# Altium schematic sheet PIC32.SchDoc
size A; PageSetup: Record=PageOptions|CenterHorizontal=True|CenterVertical=True|PrintScale=1.07|XCorrection=1.00|YCorrection=1.00|PrintKind=1|BorderSize=5000000|LeftOffset=0|BottomOffset=0|Orientation=2|PaperLength=1000|PaperWidth=1000|Scale=100|PaperSource=7|PrintQuality=-4|MediaType=1|DitherType=10|PaperKind=A5|PrintScaleMode=1
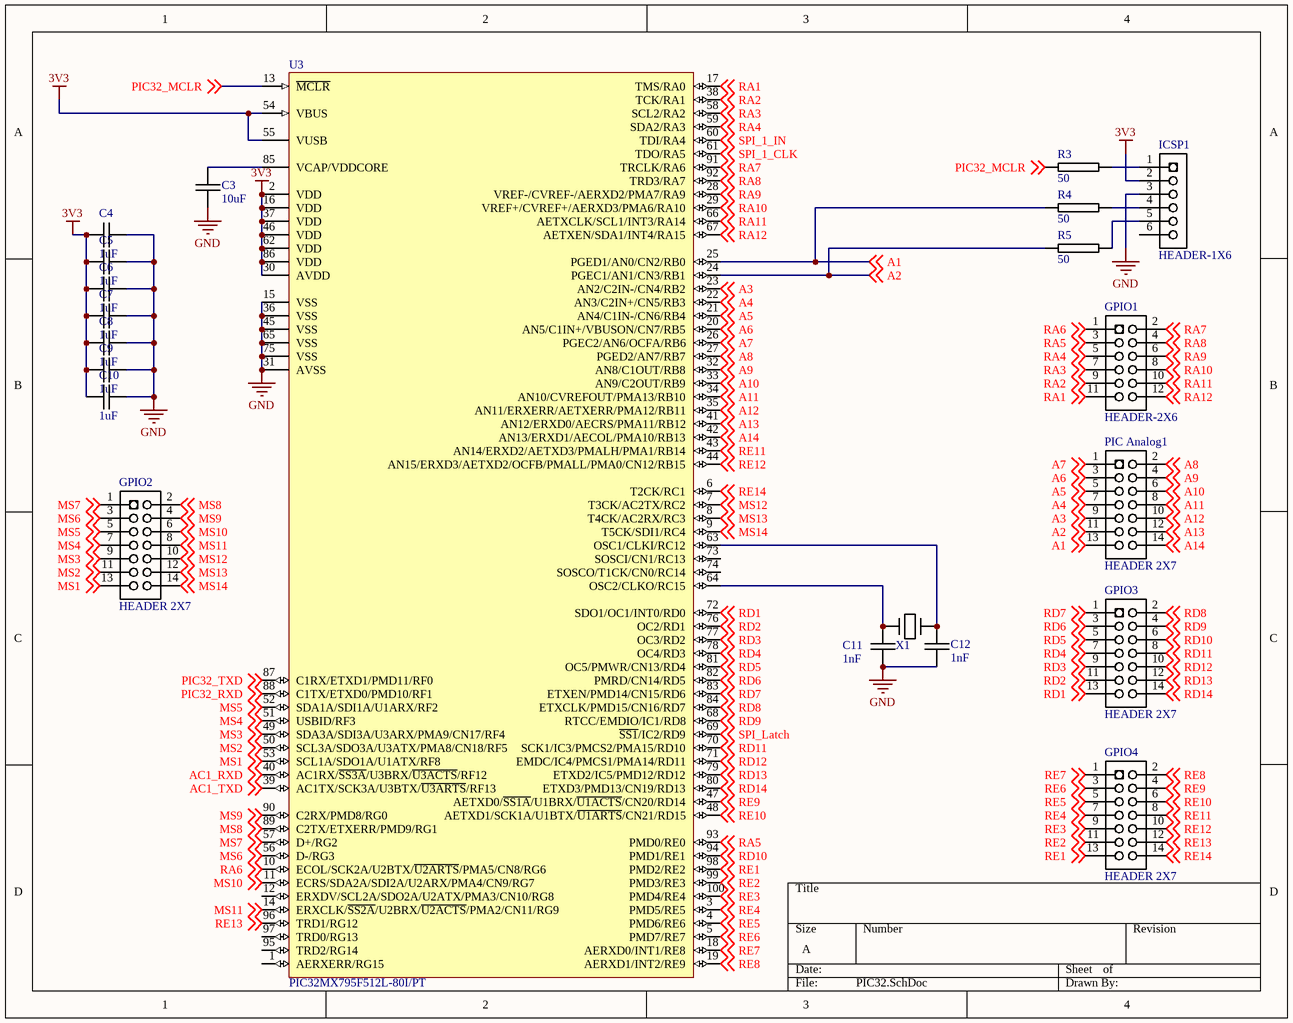
[diagram p0: PIC32.SchDoc]

## Parts
C3  10uF  [0603C-GENERIC]
C4  1uF  [0603C-GENERIC]
C5  1uF  [0603C-GENERIC]
C6  1uF  [0603C-GENERIC]
C7  1uF  [0603C-GENERIC]
C8  1uF  [0603C-GENERIC]
C9  1uF  [0603C-GENERIC]
C10  1uF  [0603C-GENERIC]
C11  1nF  [0603C-GENERIC]
C12  1nF  [0603C-GENERIC]
GPIO1  HEADER-2X6  [HEADER-2X6]
GPIO2  HEADER 2X7  [HEADER-2X7]
GPIO3  HEADER 2X7  [HEADER-2X7]
GPIO4  HEADER 2X7  [HEADER-2X7]
ICSP1  HEADER-1X6  [HEADER-1X6]
PIC_Analog1  HEADER 2X7  [HEADER-2X7]
R3  50  [0603R-TBD]
R4  50  [0603R-TBD]
R5  50  [0603R-TBD]
U3  PIC32MX795F512L-80I/PT  [TQFP-PT100_N]
X1  CRYSTAL-GENERIC  [XTAL-RU49/4]  (value not drawn)

## Nets
3V3: C4.1 C5.1 C6.1 C7.1 C8.1 C9.1 C10.1 ICSP1.2 U3.2(VDD) U3.16(VDD) U3.30(AVDD) U3.37(VDD) U3.46(VDD) U3.54(VBUS) U3.55(VUSB) U3.62(VDD) U3.86(VDD)
GND: C3.2 C4.2 C5.2 C6.2 C7.2 C8.2 C9.2 C10.2 C11.2 C12.2 ICSP1.3 U3.15(VSS) U3.31(AVSS) U3.36(VSS) U3.45(VSS) U3.65(VSS) U3.75(VSS)
A1: PIC_Analog1.13 R4.1 U3.25(PGED1/AN0/CN2/RB0) ; off-sheet A1
A2: PIC_Analog1.11 R5.2 U3.24(PGEC1/AN1/CN3/RB1) ; off-sheet A2
A3: PIC_Analog1.9 U3.23(AN2/C2IN-/CN4/RB2) ; off-sheet A3
A4: PIC_Analog1.7 U3.22(AN3/C2IN+/CN5/RB3) ; off-sheet A4
A5: PIC_Analog1.5 U3.21(AN4/C1IN-/CN6/RB4) ; off-sheet A5
A6: PIC_Analog1.3 U3.20(AN5/C1IN+/VBUSON/CN7/RB5) ; off-sheet A6
A7: PIC_Analog1.1 U3.26(PGEC2/AN6/OCFA/RB6) ; off-sheet A7
A8: PIC_Analog1.2 U3.27(PGED2/AN7/RB7) ; off-sheet A8
A9: PIC_Analog1.4 U3.32(AN8/C1OUT/RB8) ; off-sheet A9
A10: PIC_Analog1.6 U3.33(AN9/C2OUT/RB9) ; off-sheet A10
A11: PIC_Analog1.8 U3.34(AN10/CVREFOUT/PMA13/RB10) ; off-sheet A11
A12: PIC_Analog1.10 U3.35(AN11/ERXERR/AETXERR/PMA12/RB11) ; off-sheet A12
A13: PIC_Analog1.12 U3.41(AN12/ERXD0/AECRS/PMA11/RB12) ; off-sheet A13
A14: PIC_Analog1.14 U3.42(AN13/ERXD1/AECOL/PMA10/RB13) ; off-sheet A14
AC1_RXD: U3.40(AC1RX/~{SS3A}/U3BRX/~{U3ACTS}/RF12) ; off-sheet AC1_RXD
AC1_TXD: U3.39(AC1TX/SCK3A/U3BTX/~{U3ARTS}/RF13) ; off-sheet AC1_TXD
MS1: GPIO2.13 U3.53(SCL1A/SDO1A/U1ATX/RF8) ; off-sheet MS1
MS2: GPIO2.11 U3.50(SCL3A/SDO3A/U3ATX/PMA8/CN18/RF5) ; off-sheet MS2
MS3: GPIO2.9 U3.49(SDA3A/SDI3A/U3ARX/PMA9/CN17/RF4) ; off-sheet MS3
MS4: GPIO2.7 U3.51(USBID/RF3) ; off-sheet MS4
MS5: GPIO2.5 U3.52(SDA1A/SDI1A/U1ARX/RF2) ; off-sheet MS5
MS6: GPIO2.3 U3.56(D-/RG3) ; off-sheet MS6
MS7: GPIO2.1 U3.57(D+/RG2) ; off-sheet MS7
MS8: GPIO2.2 U3.89(C2TX/ETXERR/PMD9/RG1) ; off-sheet MS8
MS9: GPIO2.4 U3.90(C2RX/PMD8/RG0) ; off-sheet MS9
MS10: GPIO2.6 U3.11(ECRS/SDA2A/SDI2A/U2ARX/PMA4/CN9/RG7) ; off-sheet MS10
MS11: GPIO2.8 U3.14(ERXCLK/~{SS2A}/U2BRX/~{U2ACTS}/PMA2/CN11/RG9) ; off-sheet MS11
MS12: GPIO2.10 U3.7(T3CK/AC2TX/RC2) ; off-sheet MS12
MS13: GPIO2.12 U3.8(T4CK/AC2RX/RC3) ; off-sheet MS13
MS14: GPIO2.14 U3.9(T5CK/SDI1/RC4) ; off-sheet MS14
PIC32_MCLR: R3.2 U3.13(~{MCLR}) ; off-sheet PIC32_MCLR
PIC32_RXD: U3.88(C1TX/ETXD0/PMD10/RF1) ; off-sheet PIC32_RXD
PIC32_TXD: U3.87(C1RX/ETXD1/PMD11/RF0) ; off-sheet PIC32_TXD
RA1: GPIO1.11 U3.17(TMS/RA0) ; off-sheet RA1
RA2: GPIO1.9 U3.38(TCK/RA1) ; off-sheet RA2
RA3: GPIO1.7 U3.58(SCL2/RA2) ; off-sheet RA3
RA4: GPIO1.5 U3.59(SDA2/RA3) ; off-sheet RA4
RA5: GPIO1.3 U3.93(PMD0/RE0) ; off-sheet RA5
RA6: GPIO1.1 U3.10(ECOL/SCK2A/U2BTX/~{U2ARTS}/PMA5/CN8/RG6) ; off-sheet RA6
RA7: GPIO1.2 U3.91(TRCLK/RA6) ; off-sheet RA7
RA8: GPIO1.4 U3.92(TRD3/RA7) ; off-sheet RA8
RA9: GPIO1.6 U3.28(VREF-/CVREF-/AERXD2/PMA7/RA9) ; off-sheet RA9
RA10: GPIO1.8 U3.29(VREF+/CVREF+/AERXD3/PMA6/RA10) ; off-sheet RA10
RA11: GPIO1.10 U3.66(AETXCLK/SCL1/INT3/RA14) ; off-sheet RA11
RA12: GPIO1.12 U3.67(AETXEN/SDA1/INT4/RA15) ; off-sheet RA12
RD1: GPIO3.13 U3.72(SDO1/OC1/INT0/RD0) ; off-sheet RD1
RD2: GPIO3.11 U3.76(OC2/RD1) ; off-sheet RD2
RD3: GPIO3.9 U3.77(OC3/RD2) ; off-sheet RD3
RD4: GPIO3.7 U3.78(OC4/RD3) ; off-sheet RD4
RD5: GPIO3.5 U3.81(OC5/PMWR/CN13/RD4) ; off-sheet RD5
RD6: GPIO3.3 U3.82(PMRD/CN14/RD5) ; off-sheet RD6
RD7: GPIO3.1 U3.83(ETXEN/PMD14/CN15/RD6) ; off-sheet RD7
RD8: GPIO3.2 U3.84(ETXCLK/PMD15/CN16/RD7) ; off-sheet RD8
RD9: GPIO3.4 U3.68(RTCC/EMDIO/IC1/RD8) ; off-sheet RD9
RD10: GPIO3.6 U3.94(PMD1/RE1) ; off-sheet RD10
RD11: GPIO3.8 U3.70(SCK1/IC3/PMCS2/PMA15/RD10) ; off-sheet RD11
RD12: GPIO3.10 U3.71(EMDC/IC4/PMCS1/PMA14/RD11) ; off-sheet RD12
RD13: GPIO3.12 U3.79(ETXD2/IC5/PMD12/RD12) ; off-sheet RD13
RD14: GPIO3.14 U3.80(ETXD3/PMD13/CN19/RD13) ; off-sheet RD14
RE1: GPIO4.13 U3.98(PMD2/RE2) ; off-sheet RE1
RE2: GPIO4.11 U3.99(PMD3/RE3) ; off-sheet RE2
RE3: GPIO4.9 U3.100(PMD4/RE4) ; off-sheet RE3
RE4: GPIO4.7 U3.3(PMD5/RE5) ; off-sheet RE4
RE5: GPIO4.5 U3.4(PMD6/RE6) ; off-sheet RE5
RE6: GPIO4.3 U3.5(PMD7/RE7) ; off-sheet RE6
RE7: GPIO4.1 U3.18(AERXD0/INT1/RE8) ; off-sheet RE7
RE8: GPIO4.2 U3.19(AERXD1/INT2/RE9) ; off-sheet RE8
RE9: GPIO4.4 U3.47(AETXD0/~{SS1A}/U1BRX/~{U1ACTS}/CN20/RD14) ; off-sheet RE9
RE10: GPIO4.6 U3.48(AETXD1/SCK1A/U1BTX/~{U1ARTS}/CN21/RD15) ; off-sheet RE10
RE11: GPIO4.8 U3.43(AN14/ERXD2/AETXD3/PMALH/PMA1/RB14) ; off-sheet RE11
RE12: GPIO4.10 U3.44(AN15/ERXD3/AETXD2/OCFB/PMALL/PMA0/CN12/RB15) ; off-sheet RE12
RE13: GPIO4.12 U3.96(TRD1/RG12) ; off-sheet RE13
RE14: GPIO4.14 U3.6(T2CK/RC1) ; off-sheet RE14
SPI_1_CLK: U3.61(TDO/RA5) ; off-sheet SPI_1_CLK
SPI_1_IN: U3.60(TDI/RA4) ; off-sheet SPI_1_IN
SPI_Latch: U3.69(~{SS1}/IC2/RD9) ; off-sheet SPI_Latch
NetC3_1: C3.1 U3.85(VCAP/VDDCORE)
NetC11_1: C11.1 U3.64(OSC2/CLKO/RC15) X1.1
NetC12_1: C12.1 U3.63(OSC1/CLKI/RC12) X1.2
NetICSP1_1: ICSP1.1 R3.1
NetICSP1_4: ICSP1.4 R4.2
NetICSP1_5: ICSP1.5 R5.1

Not connected (* = marked no-connect by the designer): ICSP1 6; U3 1(AERXERR/RG15) 12(ERXDV/SCL2A/SDO2A/U2ATX/PMA3/CN10/RG8) 73(SOSCI/CN1/RC13) 74(SOSCO/T1CK/CN0/RC14) 95(TRD2/RG14) 97(TRD0/RG13)

## Library data of the parts
C3-C10 = 0603C-1UF-35V-X5R-TAY: CAPACITOR 0603 CERAMIC; Manufacturer Part Number: GMK107BJ105KA-T; Manufacturer: Taiyo Yuden; Reel: C92; Supplier 1: Digi-Key; Supplier Part Number 1: 587-1437-2-ND
C11 C12 = 0603C-000: CAPACITOR 0603 CERAMIC
GPIO2-GPIO4 PIC_Analog1 = HEADER-2X7
R3-R5 = 0603R-TBD: RESISTOR 0603 VALUE TO BE DETERMINED
U3 = PIC32MX795F512L-80I/PT: High Performance 80 MHz MIPS-Based 32-Bit Flash Microcontroller with USB, CAN and Ethernet, 512KB Program Memory, 100-pin TQFP, Industrial Temperature; Published: 2-Dec-2009; DatasheetVersion: revB, Nov-2009; PackageVersion: revBB, Aug-2009; PackageReference: TQFP-PT100; Publisher: Altium Limited; PackageDescription: 100-Lead Plastic Thin Quad Flatpack (PT) - 12x12x1mm Body, 2.00mm [TQFP]; Supplier 1: Digi-Key; Supplier Part Number 1: PIC32MX795F512L-80I/PT-ND; Supplier 2: Farnell; Supplier Part Number 2: 1778492; ComponentLink1Description: Datasheet; ComponentLink1URL: http://ww1.microchip.com/downloads/en/DeviceDoc/DS-61156B.pdf; ComponentLink2Description: Packaging Specification; ComponentLink2URL: http://ww1.microchip.com/downloads/en/PackagingSpec/en012702.pdf; ComponentLink3Description: Microchip.com Home; ComponentLink3URL: http://www.microchip.com/
X1 = CRYSTAL-GENERIC: GENERIC CRYSTAL
ICSP1 = HEADER-1X6: Supplier 1: Digi-Key; Supplier Part Number 1: S1011E-36-ND